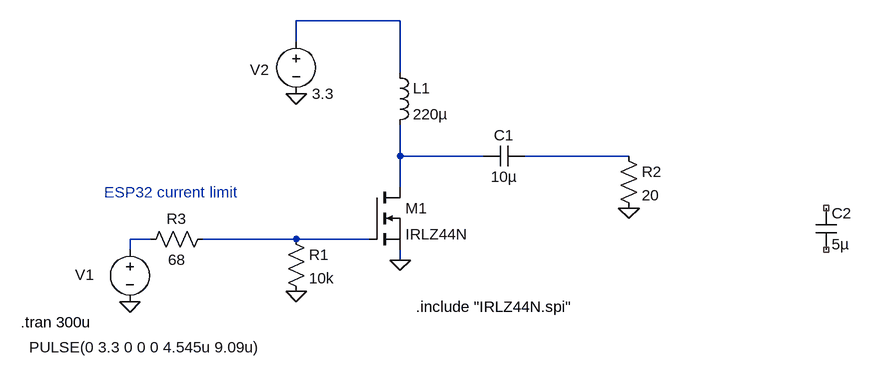
[diagram p0: schematic with_irlz44N.asc]
with_irlz44N.asc, the LTspice schematic file:
Version 4.1
SHEET 1 1428 680
WIRE 256 -144 96 -144
WIRE 96 -112 96 -144
WIRE 256 -64 256 -144
WIRE 256 64 256 16
WIRE 384 64 256 64
WIRE 608 64 448 64
WIRE 256 112 256 64
WIRE -128 192 -160 192
WIRE 96 192 -48 192
WIRE 208 192 96 192
WIRE -160 208 -160 192
WIRE 256 224 256 208
FLAG -160 288 0
FLAG 96 272 0
FLAG 256 224 0
FLAG 96 -32 0
FLAG 608 144 0
SYMBOL res 80 176 R0
SYMATTR InstName R1
SYMATTR Value 10k
SYMBOL voltage -160 192 R0
WINDOW 0 -84 55 Left 2
WINDOW 3 -155 166 Left 2
WINDOW 123 0 0 Left 0
WINDOW 39 0 0 Left 0
SYMATTR InstName V1
SYMATTR Value PULSE(0 3.3 0 0 0 4.545u 9.09u)
SYMBOL voltage 96 -128 R0
WINDOW 0 -71 59 Left 2
WINDOW 123 0 0 Left 0
WINDOW 39 0 0 Left 0
SYMATTR InstName V2
SYMATTR Value 3.3
SYMBOL ind 240 -80 R0
SYMATTR InstName L1
SYMATTR Value 220µ
SYMBOL cap 448 48 R90
WINDOW 0 0 32 VBottom 2
WINDOW 3 32 32 VTop 2
SYMATTR InstName C1
SYMATTR Value 10µ
SYMBOL nmos 208 112 R0
SYMATTR InstName M1
SYMATTR Value IRLZ44N
SYMATTR Prefix X
SYMBOL res 592 48 R0
SYMATTR InstName R2
SYMATTR Value 20
SYMBOL cap 896 144 R0
SYMATTR InstName C2
SYMATTR Value 5µ
SYMBOL res -32 176 R90
WINDOW 0 0 56 VBottom 2
WINDOW 3 32 56 VTop 2
SYMATTR InstName R3
SYMATTR Value 68
TEXT -328 320 Left 2 !.tran 300u
TEXT 280 296 Left 2 !.include "IRLZ44N.spi"
TEXT -200 120 Left 2 ;ESP32 current limit

The netlist it stands for:
* with_irlz44N.asc
R1 N005 0 10k
V1 N004 0 PULSE(0 3.3 0 0 0 4.545u 9.09u)
V2 N001 0 3.3
L1 N001 N002 220µ
C1 N003 N002 10µ
X§M1 N002 N005 0 IRLZ44N  ; pins D G S
R2 N003 0 20
C2 NC_01 NC_02 5µ
R3 N005 N004 68
.tran 300u
.include "IRLZ44N.spi"
* ESP32 current limit
.backanno
.end